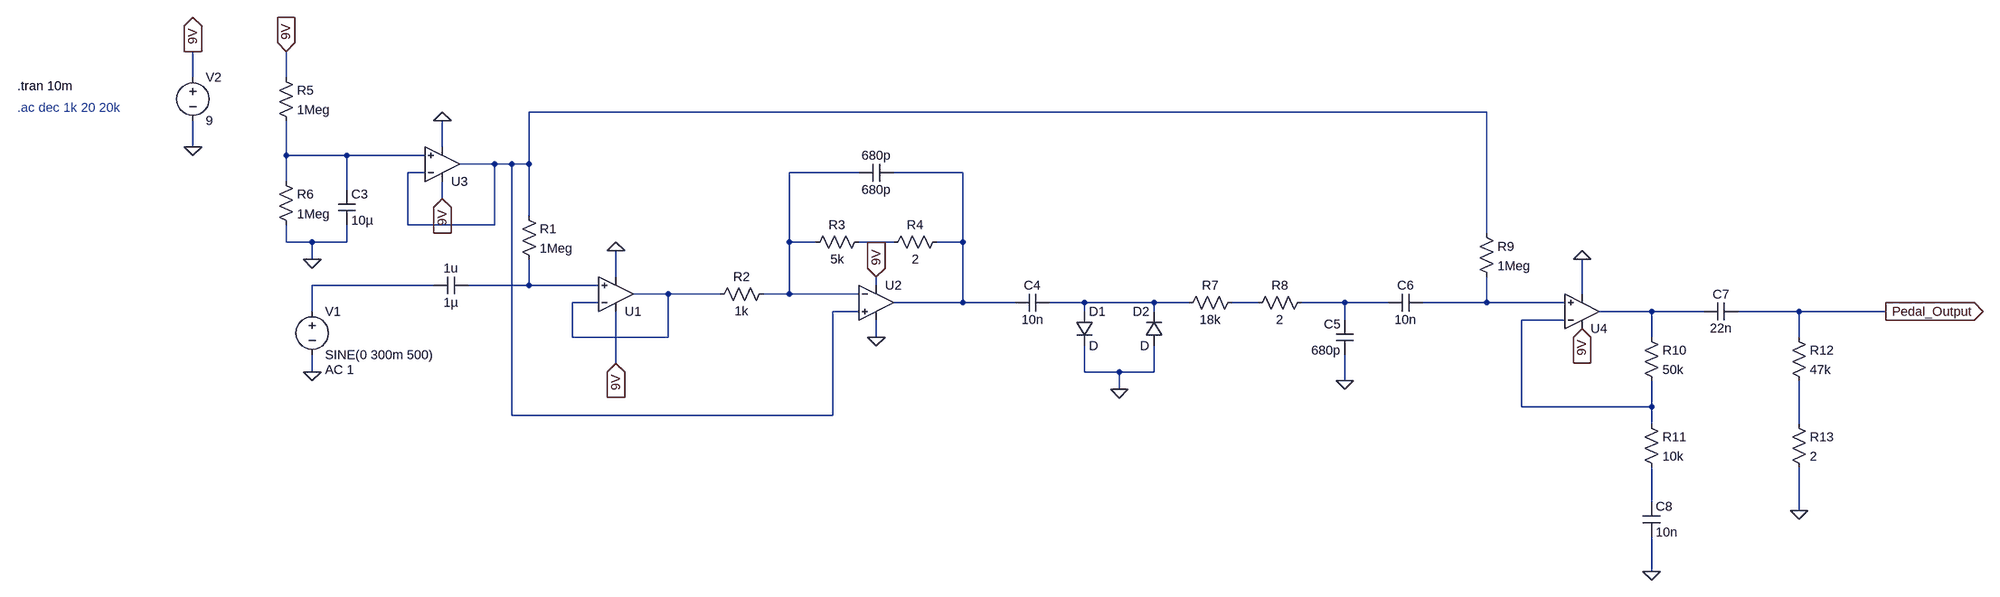
[diagram p0: schematic Full_Draft.asc]
Full_Draft.asc, the LTspice schematic file:
Version 4.1
SHEET 1 3788 680
WIRE 160 -304 160 -352
WIRE 592 -304 592 -352
WIRE 2832 -240 1040 -240
WIRE 160 -176 160 -224
WIRE 880 -176 880 -224
WIRE 592 -160 592 -224
WIRE 704 -160 592 -160
WIRE 848 -160 704 -160
WIRE 976 -144 912 -144
WIRE 1008 -144 976 -144
WIRE 1040 -144 1040 -240
WIRE 1040 -144 1008 -144
WIRE 848 -128 816 -128
WIRE 1648 -128 1520 -128
WIRE 1840 -128 1712 -128
WIRE 592 -112 592 -160
WIRE 704 -96 704 -160
WIRE 880 -80 880 -112
WIRE 1040 -48 1040 -144
WIRE 816 -32 816 -128
WIRE 976 -32 976 -144
WIRE 976 -32 816 -32
WIRE 2832 -16 2832 -240
WIRE 592 0 592 -32
WIRE 640 0 592 0
WIRE 704 0 704 -32
WIRE 704 0 640 0
WIRE 1520 0 1520 -128
WIRE 1568 0 1520 0
WIRE 1712 0 1648 0
WIRE 1840 0 1840 -128
WIRE 1840 0 1792 0
WIRE 640 32 640 0
WIRE 1200 64 1200 16
WIRE 864 80 640 80
WIRE 1040 80 1040 32
WIRE 1040 80 928 80
WIRE 1168 80 1040 80
WIRE 1680 80 1680 64
WIRE 1296 96 1232 96
WIRE 1392 96 1296 96
WIRE 1520 96 1520 0
WIRE 1520 96 1472 96
WIRE 1648 96 1520 96
WIRE 3008 96 3008 32
WIRE 1168 112 1120 112
WIRE 1840 112 1840 0
WIRE 1840 112 1712 112
WIRE 1936 112 1840 112
WIRE 2064 112 2000 112
WIRE 2192 112 2064 112
WIRE 2256 112 2192 112
WIRE 2384 112 2336 112
WIRE 2544 112 2464 112
WIRE 2624 112 2544 112
WIRE 2832 112 2832 64
WIRE 2832 112 2688 112
WIRE 2976 112 2832 112
WIRE 640 128 640 80
WIRE 1648 128 1600 128
WIRE 2064 128 2064 112
WIRE 2192 128 2192 112
WIRE 3136 128 3040 128
WIRE 3232 128 3136 128
WIRE 3408 128 3296 128
WIRE 3568 128 3408 128
WIRE 2544 144 2544 112
WIRE 2976 144 2896 144
WIRE 1120 176 1120 112
WIRE 1296 176 1296 96
WIRE 1296 176 1120 176
WIRE 1680 176 1680 144
WIRE 3136 176 3136 128
WIRE 3408 176 3408 128
WIRE 1200 224 1200 128
WIRE 640 240 640 208
WIRE 2064 240 2064 192
WIRE 2128 240 2064 240
WIRE 2192 240 2192 192
WIRE 2192 240 2128 240
WIRE 2544 256 2544 208
WIRE 2128 272 2128 240
WIRE 2896 304 2896 144
WIRE 3136 304 3136 256
WIRE 3136 304 2896 304
WIRE 1008 320 1008 -144
WIRE 1600 320 1600 128
WIRE 1600 320 1008 320
WIRE 3136 336 3136 304
WIRE 3408 336 3408 256
WIRE 3136 480 3136 416
WIRE 3408 496 3408 416
WIRE 3136 608 3136 544
FLAG 640 240 0
FLAG 1200 16 0
FLAG 1680 176 0
FLAG 880 -224 0
FLAG 640 32 0
FLAG 160 -176 0
FLAG 160 -352 9V
IOPIN 160 -352 Out
FLAG 592 -352 9V
IOPIN 592 -352 In
FLAG 880 -80 9V
IOPIN 880 -80 In
FLAG 1200 224 9V
IOPIN 1200 224 In
FLAG 2128 272 0
FLAG 2544 256 0
FLAG 3136 608 0
FLAG 3408 496 0
FLAG 3568 128 Pedal_Output
IOPIN 3568 128 Out
FLAG 1680 64 9V
IOPIN 1680 64 In
FLAG 3008 160 9V
IOPIN 3008 160 In
FLAG 3008 32 0
SYMBOL voltage 640 112 R0
WINDOW 123 24 124 Left 2
WINDOW 39 0 0 Left 0
SYMATTR InstName V1
SYMATTR Value SINE(0 300m 500)
SYMATTR Value2 AC 1
SYMBOL cap 928 64 R90
WINDOW 0 0 32 VBottom 2
WINDOW 3 32 32 VTop 2
SYMATTR InstName 1u
SYMATTR Value 1µ
SYMBOL res 1024 -64 R0
SYMATTR InstName R1
SYMATTR Value 1Meg
SYMBOL OpAmps\\UniversalOpAmp 1200 96 M180
SYMATTR InstName U1
SYMBOL res 1488 80 R90
WINDOW 0 0 56 VBottom 2
WINDOW 3 32 56 VTop 2
SYMATTR InstName R2
SYMATTR Value 1k
SYMBOL res 1664 -16 R90
WINDOW 0 0 56 VBottom 2
WINDOW 3 32 56 VTop 2
SYMATTR InstName R3
SYMATTR Value 5k
SYMBOL res 1808 -16 R90
WINDOW 0 0 56 VBottom 2
WINDOW 3 32 56 VTop 2
SYMATTR InstName R4
SYMATTR Value 2
SYMBOL cap 1712 -144 R90
WINDOW 0 0 32 VBottom 2
WINDOW 3 32 32 VTop 2
SYMATTR InstName 680p
SYMATTR Value 680p
SYMBOL OpAmps\\UniversalOpAmp 1680 112 R0
SYMATTR InstName U2
SYMBOL res 576 -320 R0
SYMATTR InstName R5
SYMATTR Value 1Meg
SYMBOL res 576 -128 R0
SYMATTR InstName R6
SYMATTR Value 1Meg
SYMBOL OpAmps\\UniversalOpAmp 880 -144 M180
SYMATTR InstName U3
SYMBOL cap 688 -96 R0
SYMATTR InstName C3
SYMATTR Value 10µ
SYMBOL voltage 160 -320 R0
WINDOW 123 24 44 Left 2
WINDOW 39 0 0 Left 0
SYMATTR InstName V2
SYMATTR Value 9
SYMBOL cap 2000 96 R90
WINDOW 0 0 32 VBottom 2
WINDOW 3 32 32 VTop 2
SYMATTR InstName C4
SYMATTR Value 10n
SYMBOL diode 2048 128 R0
SYMATTR InstName D1
SYMBOL diode 2208 192 R180
WINDOW 0 24 64 Left 2
WINDOW 3 24 0 Left 2
SYMATTR InstName D2
SYMBOL res 2352 96 R90
WINDOW 0 0 56 VBottom 2
WINDOW 3 32 56 VTop 2
SYMATTR InstName R7
SYMATTR Value 18k
SYMBOL res 2480 96 R90
WINDOW 0 0 56 VBottom 2
WINDOW 3 32 56 VTop 2
SYMATTR InstName R8
SYMATTR Value 2
SYMBOL cap 2560 208 R180
WINDOW 0 24 56 Left 2
WINDOW 3 24 8 Left 2
SYMATTR InstName C5
SYMATTR Value 680p
SYMBOL cap 2624 128 R270
WINDOW 0 32 32 VTop 2
WINDOW 3 0 32 VBottom 2
SYMATTR InstName C6
SYMATTR Value 10n
SYMBOL OpAmps\\UniversalOpAmp 3008 128 M180
SYMATTR InstName U4
SYMBOL res 2816 -32 R0
SYMATTR InstName R9
SYMATTR Value 1Meg
SYMBOL cap 3296 112 R90
WINDOW 0 0 32 VBottom 2
WINDOW 3 32 32 VTop 2
SYMATTR InstName C7
SYMATTR Value 22n
SYMBOL res 3120 160 R0
SYMATTR InstName R10
SYMATTR Value 50k
SYMBOL res 3120 320 R0
SYMATTR InstName R11
SYMATTR Value 10k
SYMBOL cap 3120 480 R0
SYMATTR InstName C8
SYMATTR Value 10n
SYMBOL res 3392 160 R0
SYMATTR InstName R12
SYMATTR Value 47k
SYMBOL res 3392 320 R0
SYMATTR InstName R13
SYMATTR Value 2
TEXT -192 -248 Left 2 ;.ac dec 1k 20 20k
TEXT -192 -288 Left 2 !.tran 10m

The netlist it stands for:
* Full_Draft.asc
V1 N006 0 SINE(0 300m 500) AC 1
C§1u N007 N006 1µ
R1 N001 N007 1Meg
X§U1 N007 N008 9V 0 N008 level1 Avol=1Meg GBW=10Meg Vos=0 En=0 Enk=0 In=0 Ink=0 Rin=500Meg  ; pins In+ In- V+ V- OUT
R2 N003 N008 1k
R3 N005 N003 5k
R4 N004 N005 2
C§680p N004 N003 680p
X§U2 N001 N003 9V 0 N004 level1 Avol=1Meg GBW=10Meg Vos=0 En=0 Enk=0 In=0 Ink=0 Rin=500Meg  ; pins In+ In- V+ V- OUT
R5 9V N002 1Meg
R6 N002 0 1Meg
X§U3 N002 N001 9V 0 N001 level1 Avol=1Meg GBW=10Meg Vos=0 En=0 Enk=0 In=0 Ink=0 Rin=500Meg  ; pins In+ In- V+ V- OUT
C3 N002 0 10µ
V2 9V 0 9
C4 N009 N004 10n
D1 N009 0 D
D2 0 N009 D
R7 N010 N009 18k
R8 N011 N010 2
C5 0 N011 680p
C6 N011 N012 10n
X§U4 N012 N014 9V 0 N013 level1 Avol=1Meg GBW=10Meg Vos=0 En=0 Enk=0 In=0 Ink=0 Rin=500Meg  ; pins In+ In- V+ V- OUT
R9 N001 N012 1Meg
C7 Pedal_Output N013 22n
R10 N013 N014 50k
R11 N014 N016 10k
C8 N016 0 10n
R12 Pedal_Output N015 47k
R13 N015 0 2
.model D D
.lib standard.dio
* .ac dec 1k 20 20k
.tran 10m
.lib UniversalOpAmp1.lib
.backanno
.end